# Altium schematic sheet RHN-JD-SCH11V1.00.SchDoc: #
size A4; Date: 20190120; CheckedBy: #; CompanyName: 瑞臻信息（深圳）有限公司; DrawnBy: Bob.Xu; Address1: 深圳市南山区深南路万利达大厦2201室; Address2: 昆山市花桥镇花桥国际商务城绿地大道231弄9号楼杰座大厦2111室; Address3: 成都市高新区天府二街138号蜀都中心3号楼3110室; Address4: 浙江省宁波市余姚市冶山路475号1401室; Revision: V1.01; SheetOf: 1/2; ProductTitle: 农业项目-集中器; : CheckedBy; CheckedByDate: #; PageSetup: Record=PageOptions|CenterHorizontal=True|CenterVertical=True|PrintScale=0.73|XCorrection=1.00|YCorrection=1.00|PrintKind=0|BorderSize=5000000|LeftOffset=0|BottomOffset=0|Orientation=2|PaperLength=1000|PaperWidth=1000|Scale=100|PaperSource=7|PrintQuality=-3|MediaType=1|DitherType=10|PrintScaleMode=1|PaperKind=A4|PaperIndex=9
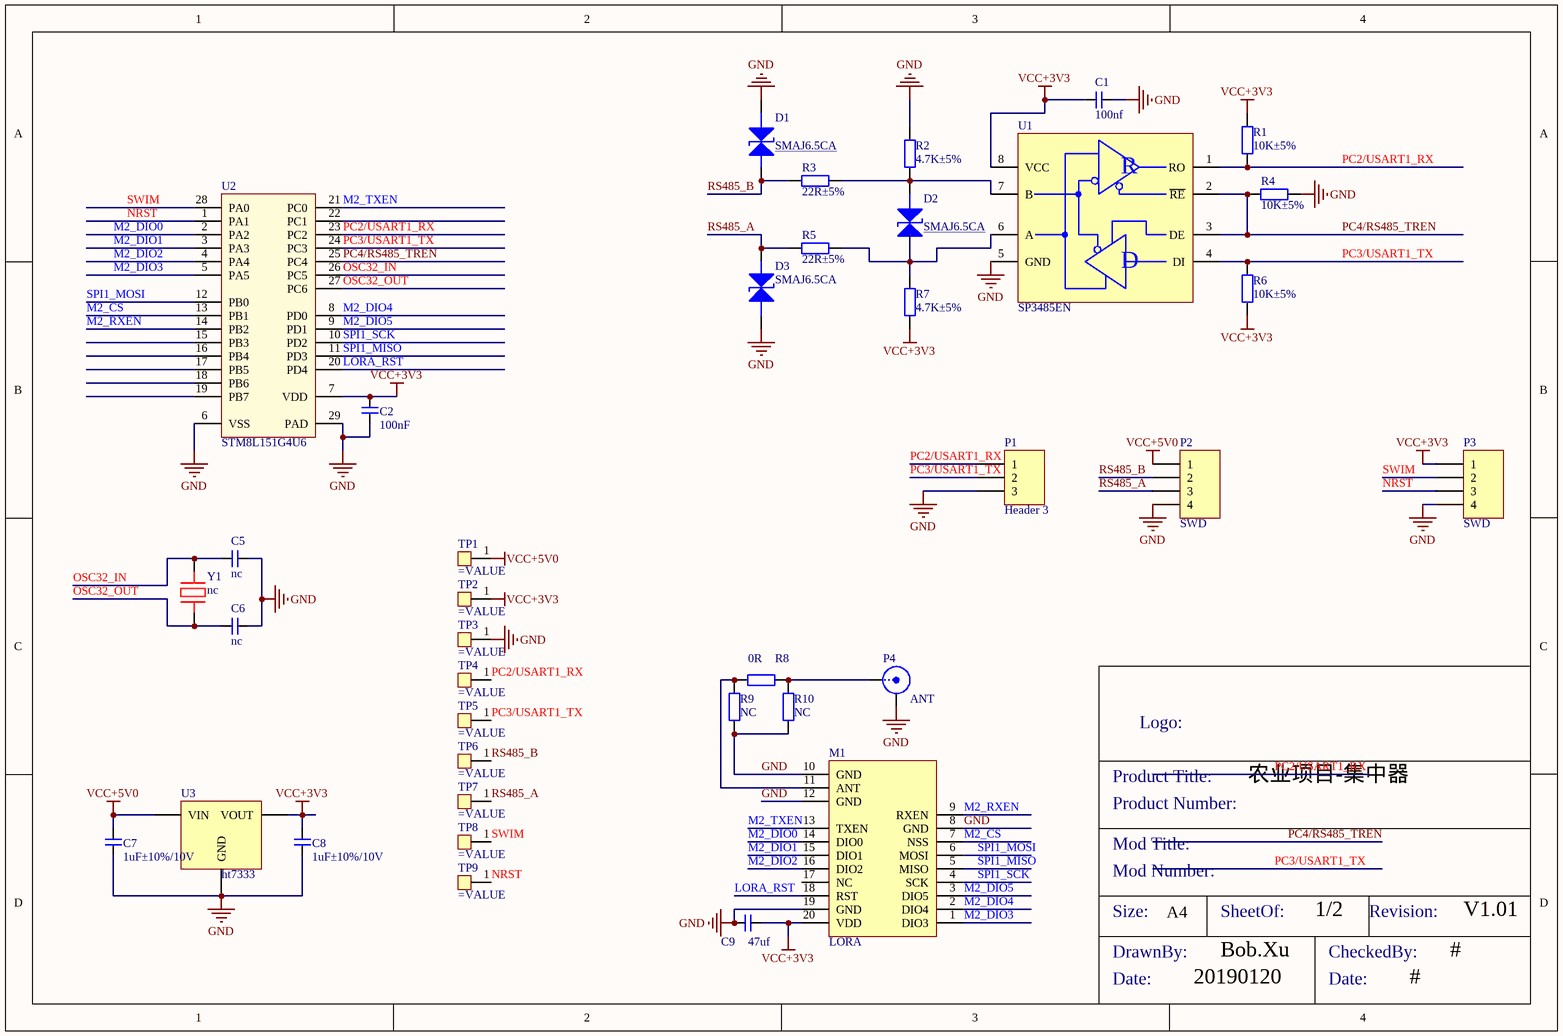
[diagram p0: RHN-JD-SCH11V1.00.SchDoc]

## Parts
C1  100nf  [c0402]
C2  100nF  [C0402]
C5  nc  [C0402]
C6  nc  [C0402]
C7  1uF±10%/10V  [C0402]
C8  1uF±10%/10V  [C0402]
C9  47uf  [C1206]
D1  SMAJ6.5CA  [SMB_2P_3R9X4R6]
D2  SMAJ6.5CA  [SMB_2P_3R9X4R6]
D3  SMAJ6.5CA  [SMB_2P_3R9X4R6]
M1  LORA  [LORA_PIN_1]
P1  Header 3  [HDR1X3]
P2  SWD  [HDR1X4]
P3  SWD  [HDR1X4]
P4  ANT  [BNC_RA CON]
R1  10K±5%  [R0402]
R2  4.7K±5%  [R0402]
R3  22R±5%  [R0402]
R4  10K±5%  [R0402]
R5  22R±5%  [R0402]
R6  10K±5%  [R0402]
R7  4.7K±5%  [R0402]
R8  0R  [R0402]
R9  NC  [R0402]
R10  NC  [R0402]
TP1  (no value)  [TP_D1R25]
TP2  (no value)  [TP_D1R25]
TP3  (no value)  [TP_D1R25]
TP4  (no value)  [TP_D1R25]
TP5  (no value)  [TP_D1R25]
TP6  (no value)  [TP_D1R25]
TP7  (no value)  [TP_D1R25]
TP8  (no value)  [TP_D1R25]
TP9  (no value)  [TP_D1R25]
U1  SP3485EN  [SOP_8P_1R27_3R9X4R9]
U2  STM8L151G4U6  [QFN_28P_0R5_5R0X5R0_P]
U3  ht7333  [SOT89_3P_1R5_2R5X4R5]
Y1  nc  [SMD_Crystal_2P_1R5X3R2]

## Nets
GND: C1.2 C2.1 C5.1 C6.1 C7.1 C8.1 C9.1 D1.2(K) D3.2(K) M1.8(GND) M1.10(GND) M1.12(GND) M1.19(GND) P1.3 P2.4 P3.4 P4.2(Y) R2.2 R4.2 R9.2 R10.2 TP3.1 U1.5(GND) U2.6(VSS) U2.29(PAD) U3.1(GND)
VCC+3V3: C1.1 C2.2 C8.2 C9.2 M1.20(VDD) P3.1 R1.2 R6.1 R7.1 TP2.1 U1.8(VCC) U2.7(VDD) U3.3(VOUT)
VCC+5V0: C7.2 P2.1 TP1.1 U3.2(VIN)
LORA_RST: M1.18(RST) U2.20(PD4)
M2_CS: M1.7(NSS) U2.13(PB1)
M2_DIO0: M1.14(DIO0) U2.2(PA2)
M2_DIO1: M1.15(DIO1) U2.3(PA3)
M2_DIO2: M1.16(DIO2) U2.4(PA4)
M2_DIO3: M1.1(DIO3) U2.5(PA5)
M2_DIO4: M1.2(DIO4) U2.8(PD0)
M2_DIO5: M1.3(DIO5) U2.9(PD1)
M2_RXEN: M1.9(RXEN) U2.14(PB2)
M2_TXEN: M1.13(TXEN) U2.21(PC0)
NRST: P3.3 TP9.1 U2.1(PA1)
OSC32_IN: C5.2 U2.26(PC5) Y1.2
OSC32_OUT: C6.2 U2.27(PC6) Y1.1
PC2/USART1_RX: P1.1 R1.1 TP4.1 U1.1(RO) U2.23(PC2)
PC3/USART1_TX: P1.2 R6.2 TP5.1 U1.4(DI) U2.24(PC3)
PC4/RS485_TREN: R4.1 U1.2(~{RE}) U1.3(DE) U2.25(PC4)
RS485_A: D3.1(A) P2.3 R5.2 TP7.1
RS485_B: D1.1(A) P2.2 R3.2 TP6.1
SPI1_MISO: M1.5(MISO) U2.11(PD3)
SPI1_MOSI: M1.6(MOSI) U2.12(PB0)
SPI1_SCK: M1.4(SCK) U2.10(PD2)
SWIM: P3.2 TP8.1 U2.28(PA0)
NetD2_1: D2.1(A) R5.1 R7.2 U1.6(A)
NetD2_2: D2.2(K) R2.1 R3.1 U1.7(B)
NetM1_11: M1.11(ANT) R8.2 R9.1
NetP4_1: P4.1(X) R8.1 R10.1

Not connected (* = marked no-connect by the designer): M1 17(NC); U2 15(PB3) 16(PB4) 17(PB5) 18(PB6) 19(PB7) 22(PC1)

## Notes on the sheet
- Product Title:
- Logo:
- Product Number:
- Mod Title:
- Size:
- Mod Number:
- A4
- SheetOf:
- Revision:
- DrawnBy:
- Date:
- CheckedBy:
- (in symbol 1.2.18.09.0173) R; D

## Library data of the parts
C1 C2 C5 C6 C9 = 无极性电容
C7 C8 = 1.2.04.05.0024: MLCC_1uF±10%_10V_X5R_0402; 厂家: 三星; 器件高度: 0.5mm; 厂家型号: CL05A105KP5NNNC; D/S: S; Edit Note: V1.0-创建-20190329-徐永伟; 器件状态: 量产; Part Number: 1.2.04.05.0024; Part Type: MLCC; Value: 1uF±10%/10V; ComponentLink1URL: z:\规格书\02原材料\04电容\05瓷片电容\三星电容.pdf; Unit Price: ￥0.001; ComponentLink1Description: 规格书; Component Type: standy; Pin Count: 2; Published: V1.0; Publisher: 徐永伟
D1-D3 = 1.2.08.99.0052: 半导体放电管-P821P0080SCLRP-200A(10/160us)-It2.2A/4Vt-6Vdrm-50pF-SMB
M1 = LORA_PIN_1
P1 = Header 3: Header, 3-Pin; LatestRevisionDate: 17-Jul-2002; LatestRevisionNote: Re-released for DXP Platform.; Publisher: Altium Limited
P2 P3 = Header 4: Header, 4-Pin; LatestRevisionDate: 17-Jul-2002; LatestRevisionNote: Re-released for DXP Platform.; Publisher: Altium Limited
P4 = BNC: BNC Elbow Connector; LatestRevisionDate: 17-Jul-2002; LatestRevisionNote: Re-released for DXP Platform.; Publisher: Altium Limited
R1 R4 R6 = 1.2.03.01.0012: 电阻-10K±5%-1/16W-0402; Supplier Manufacturer: 厂家; Old P/N: 00527; D/S: S; Edit Note: V1.0-创建-20161225-徐永伟; Grade: A; Part Number: 1.2.03.01.0012; Part Type: 贴片电阻; Value: 10K±5%; ComponentLink1URL: z:\altiumdesigner\规格书\02原材料\03电阻\01普通电阻\; Supplier: 供应商; Unit Price: ￥0.001; Footprint: 0402; ComponentLink1Description: 规格书; Component Type: standy; ComponentLink2Description: ROHS报告; ComponentLink2URL: z:\altiumdesigner\规格书\02原材料\03电阻\01普通电阻\; Pin Count: 2; Published: V1.0; Publisher: 徐永伟; ComponentLink3Description: 可靠性测试报告; ComponentLink3URL: z:\altiumdesigner\规格书\02原材料\03电阻\01普通电阻\; ComponentLink4URL: z:\altiumdesigner\规格书\02原材料\03电阻\01普通电阻\; ComponentLink4Description: 性能检测报告
R2 R7 = 1.2.03.01.0366: 电阻-4.7K±5%-1/16W-0402; Supplier Manufacturer: 厂家; Old P/N: 00810; D/S: S; Edit Note: V1.0-创建-20161225-徐永伟; Grade: A; Part Number: 1.2.03.01.0366; Part Type: 贴片电阻; Value: 4.7K±5%; ComponentLink1URL: z:\altiumdesigner\规格书\02原材料\03电阻\01普通电阻\; Supplier: 供应商; Unit Price: ￥0.001; Footprint: 0402; ComponentLink1Description: 规格书; Component Type: standy; ComponentLink2Description: ROHS报告; ComponentLink2URL: z:\altiumdesigner\规格书\02原材料\03电阻\01普通电阻\; Pin Count: 2; Published: V1.0; Publisher: 徐永伟; ComponentLink3Description: 可靠性测试报告; ComponentLink3URL: z:\altiumdesigner\规格书\02原材料\03电阻\01普通电阻\; ComponentLink4URL: z:\altiumdesigner\规格书\02原材料\03电阻\01普通电阻\; ComponentLink4Description: 性能检测报告
R3 R5 = 1.2.03.01.0573: 电阻-4.7R±5%-1/16W-0402; Supplier Manufacturer: 厂家; Old P/N: 01747; Value: 4.7R±5%; D/S: S; Edit Note: V1.0-创建-20161225-徐永伟; Grade: A; Part Number: 1.2.03.01.0573; Part Type: 贴片电阻; ComponentLink1URL: z:\altiumdesigner\规格书\02原材料\03电阻\01普通电阻\; Supplier: 供应商; Unit Price: ￥0.001; Footprint: 0402; ComponentLink1Description: 规格书; Component Type: standy; ComponentLink2Description: ROHS报告; ComponentLink2URL: z:\altiumdesigner\规格书\02原材料\03电阻\01普通电阻\; Pin Count: 2; Published: V1.0; Publisher: 徐永伟; ComponentLink3Description: 可靠性测试报告; ComponentLink3URL: z:\altiumdesigner\规格书\02原材料\03电阻\01普通电阻\; ComponentLink4URL: z:\altiumdesigner\规格书\02原材料\03电阻\01普通电阻\; ComponentLink4Description: 性能检测报告
R8-R10 = 1.2.03.01.0012: 电阻-10K±5%-1/16W-0402; Supplier Manufacturer: 厂家; Old P/N: 00527; Value: 10K±5%; D/S: S; Edit Note: V1.0-创建-20161225-徐永伟; Grade: A; Part Number: 1.2.03.01.0012; Part Type: 贴片电阻; ComponentLink1URL: z:\altiumdesigner\规格书\02原材料\03电阻\01普通电阻\; Supplier: 供应商; Unit Price: ￥0.001; Footprint: 0402; ComponentLink1Description: 规格书; Component Type: standy; ComponentLink2Description: ROHS报告; ComponentLink2URL: z:\altiumdesigner\规格书\02原材料\03电阻\01普通电阻\; Pin Count: 2; Published: V1.0; Publisher: 徐永伟; ComponentLink3Description: 可靠性测试报告; ComponentLink3URL: z:\altiumdesigner\规格书\02原材料\03电阻\01普通电阻\; ComponentLink4URL: z:\altiumdesigner\规格书\02原材料\03电阻\01普通电阻\; ComponentLink4Description: 性能检测报告
TP1-TP9 = Test_Point: 测试点
U1 = 1.2.18.09.0173: RS485收发器-SP3485EN-支持485收发-SOP8; Supplier Manufacturer: Sipex; Old P/N: 00289; D/S: S; Edit Note: V1.0-创建-20170122-徐永伟; Grade: A; Part Number: 1.2.18.09.0173; ComponentLink1URL: Z:\AltiumDesigner\规格书\02原材料\18集成电路\09接口芯片\SP3485EN.pdf; ComponentLink1Description: 规格书; ComponentLink2Description: ROHS报告; Part Type: 接口IC; Value: SP3485EN; height: 1.7mm; Model: SP3485EN; Unit Price: ￥0.001; Footprint: SOP8; Component Type: standy; Pin Count: 8; Published: V1.0; Publisher: 徐永伟
U3 = 1.2.18.07.0002: HT7333_LDO稳压_100mA/3.3V_Vmax=30V_SOT89; 厂家: HOLTEK; 器件高度: 1.6mm; 单价: ￥0.001; D/S: S; Edit Note: V1.0-创建-20180709-徐永伟; 物料状态: 量产; Part Number: 1.2.18.07.0002; Part Type: LDO; Value: ht7333; ComponentLink1URL: Z:\规格书\02原材料\18集成电路\17线性稳压器\HT7333-3.pdf; 厂家型号: HT7333; Footprint: SOT89; ComponentLink1Description: 规格书; Component Type: standy; Pin Count: 3; Published: V1.0; Publisher: 徐永伟
Y1 = 两脚晶体谐振器